# EAGLE schematic schematic (EAGLE 9.6.0)
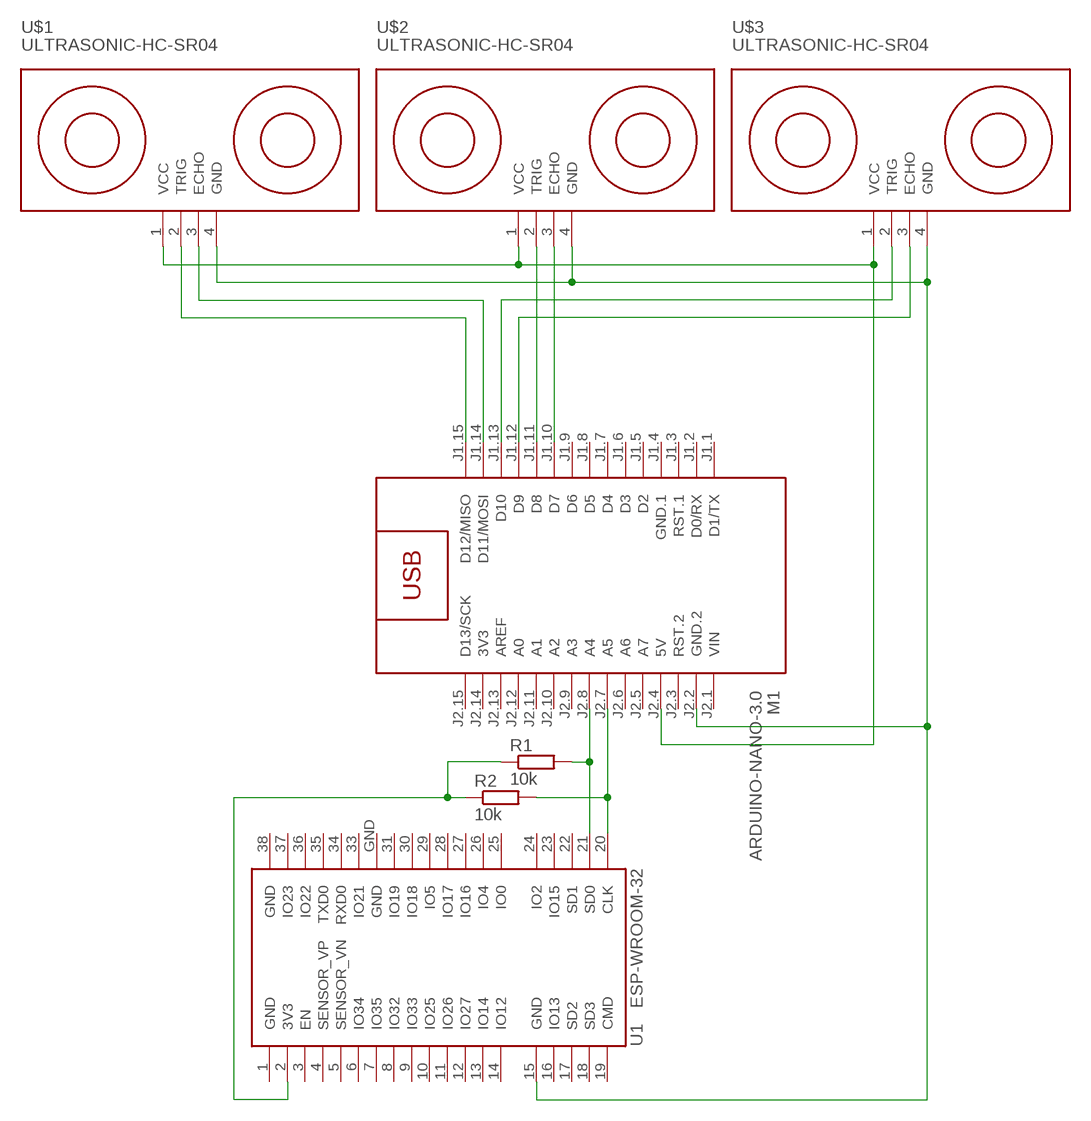
[diagram p0: schematic, sheet 1]

## Parts
M1  ARDUINO-NANO-3.0  [ARDUINO-NANO-3.0]
R1  10k  R-EU_0204/2V  [0204V]
R2  10k  R-EU_0204/2V  [0204V]
U1  ESP-WROOM-32  [ESP-WROOM-32]
U$1  ULTRASONIC-HC-SR04  [ULTRASONIC-HC-SR04]
U$2  ULTRASONIC-HC-SR04  [ULTRASONIC-HC-SR04]
U$3  ULTRASONIC-HC-SR04  [ULTRASONIC-HC-SR04]

## Nets
N$1: M1.J2.4(5V) U$1.1(VCC) U$2.1(VCC) U$3.1(VCC)
N$2: M1.J1.12(D9) U$3.3(ECHO)
N$3: M1.J1.10(D7) U$2.3(ECHO)
N$4: M1.J2.2(GND.2) U1.15(GND) U$1.4(GND) U$2.4(GND) U$3.4(GND)
N$5: M1.J1.11(D8) U$2.2(TRIG)
N$6: M1.J1.13(D10) U$3.2(TRIG)
N$7: M1.J1.14(D11/MOSI) U$1.3(ECHO)
N$8: M1.J1.15(D12/MISO) U$1.2(TRIG)
N$9: M1.J2.8(A4) R1.2 U1.21(SD0)
N$10: M1.J2.7(A5) R2.2 U1.20(CLK)
N$11: R1.1 R2.1 U1.2(3V3)
Unconnected: M1.J1.1(D1/TX) M1.J1.2(D0/RX) M1.J1.3(RST.1) M1.J1.5(D2) M1.J1.6(D3) M1.J1.7(D4) M1.J1.8(D5) M1.J1.9(D6) M1.J2.3(RST.2) M1.J2.5(A7) M1.J2.6(A6) M1.J2.9(A3) M1.J2.10(A2) M1.J2.11(A1) M1.J2.12(A0) M1.J2.13(AREF) M1.J2.15(D13/SCK) U1.3(EN) U1.4(SENSOR_VP) U1.5(SENSOR_VN) U1.6(IO34) U1.7(IO35) U1.8(IO32) U1.9(IO33) U1.10(IO25) U1.11(IO26) U1.12(IO27) U1.13(IO14) U1.14(IO12) U1.16(IO13) U1.17(SD2) U1.18(SD3) U1.19(CMD) U1.22(SD1) U1.23(IO15) U1.24(IO2) U1.25(IO0) U1.26(IO4) U1.27(IO16) U1.28(IO17) U1.29(IO5) U1.30(IO18) U1.31(IO19) U1.33(IO21) U1.34(RXD0) U1.35(TXD0) U1.36(IO22) U1.37(IO23)

## Power pins joined to a net without a drawn wire
3V3: M1.J2.14(3V3)
GND: U1.1(GND) U1.38(GND) U1.GND
GND.1: M1.J1.4(GND.1)
VIN: M1.J2.1(VIN)

## Library data of the parts
M1 = diy-modules:ARDUINO-NANO-3.0: Arduino Nano 3.0 and compatible devices More details available here: https://www.arduino.cc/en/Main/ArduinoBoardNano Click here to find device on ebay.com <http://www.ebay.com/sch/arduino+nano>
R1 R2 = rcl:R-EU_: RESISTOR, European symbol; SPICEPREFIX: R
U1 = esp32:ESP-WROOM-32: Espressif Systems ESP-WROOM-32
U$1-U$3 = diy-modules:ULTRASONIC-HC-SR04: Ultrasonic Ranging Module HC-SR04 More details available here: http://randomnerdtutorials.com/complete-guide-for-ultrasonic-sensor-hc-sr04/ Click here to find device on ebay.com <http://www.ebay.com/sch/hc+sr04+ultrasonic>